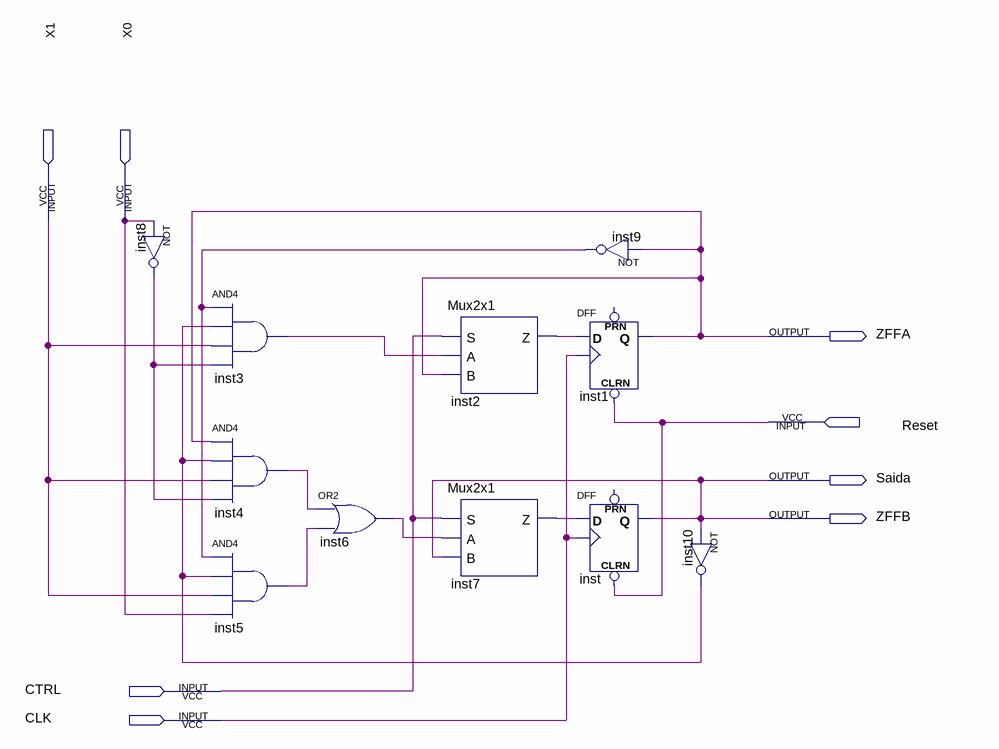
[diagram p0: schematic sheet]
// Quartus schematic MaquinaSecagem.bdf as structural Verilog: 11 symbols, 8 pins
module MaquinaSecagem (
  input  X1,
  input  X0,
  input  Reset,
  input  CTRL,
  input  CLK,
  output ZFFA,
  output Saida,
  output ZFFB
);

  wire inst2_z, inst3_out, inst4_out, inst5_out, inst6_out, inst7_z, inst8_out, inst9_out, inst10_out;

  not inst8 (inst8_out, X0);
  and inst3 (inst3_out, inst9_out, inst10_out, X1, inst8_out);
  and inst4 (inst4_out, ZFFA, inst10_out, X1, inst8_out);
  and inst5 (inst5_out, inst9_out, inst10_out, X1, X0);
  or inst6 (inst6_out, inst4_out, inst5_out);
  Mux2x1 inst2 (.S(CTRL), .A(inst3_out), .B(ZFFA), .Z(inst2_z));
  Mux2x1 inst7 (.S(CTRL), .A(inst6_out), .B(Saida), .Z(inst7_z));
  not inst9 (inst9_out, ZFFA);
  DFF inst1 (.CLRN(Reset), .CLK(CLK), .D(inst2_z), .Q(ZFFA));  // open: PRN
  DFF inst (.CLRN(Reset), .CLK(CLK), .D(inst7_z), .Q(Saida));  // open: PRN
  not inst10 (inst10_out, Saida);

  assign ZFFB = Saida;
endmodule
